# EAGLE schematic Preliminary_Schematic (EAGLE 9.5.1)
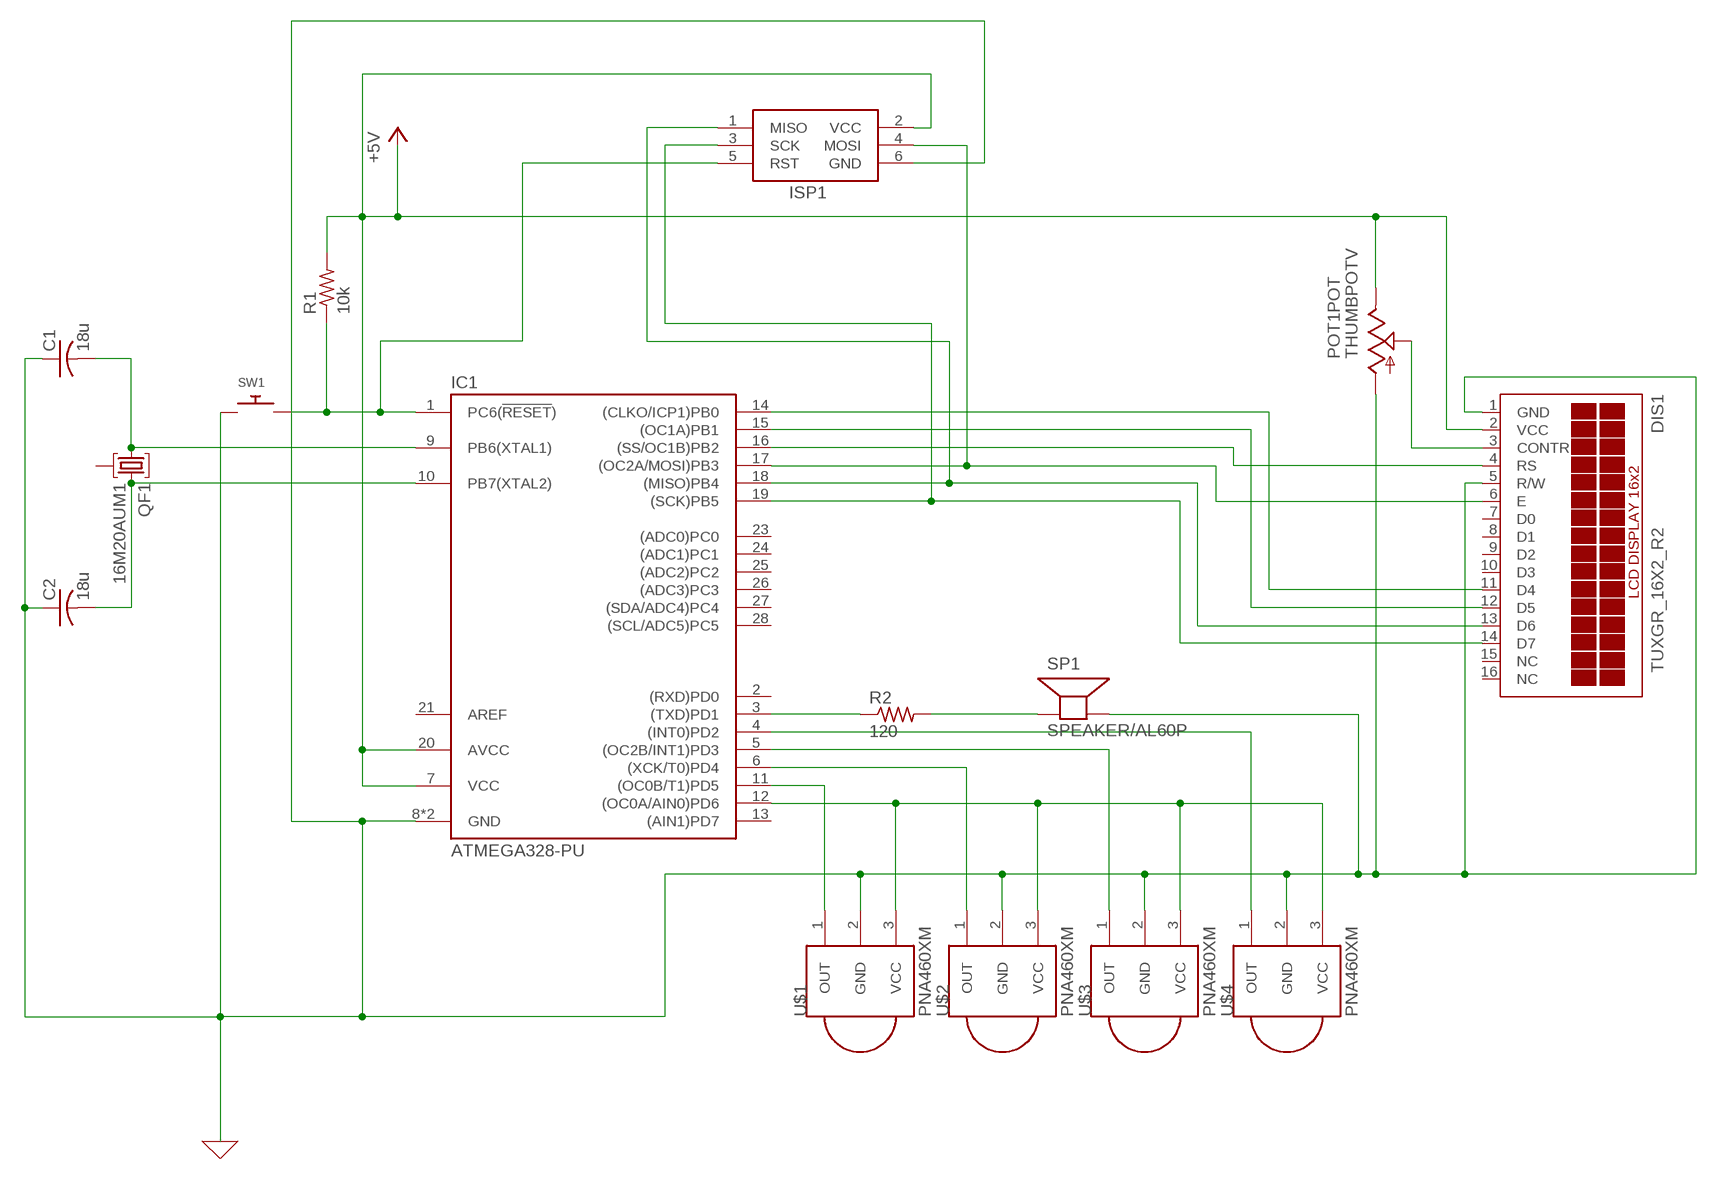
[diagram p0: schematic, sheet 1]

## Parts
C1  18u  C-USC0805  [C0805]
C2  18u  C-USC0805  [C0805]
DIS1  TUXGR_16X2_R2  [TUXGR_16X2_R2]
IC1  ATMEGA328-PU  [DIL28]
ISP1  AVRISP-6  [AVRISP]
POT1  THUMBPOTV  [THUMBWHEELV]
QF1  16M20AUM1  [UM1]
R1  10k  R-US_R0805  [R0805]
R2  120  R-US_R0805  [R0805]
SP1  SPEAKER/AL60P  [AL60P]
SW1  SWITCH_PUSHBUTTONC&K_KSS  [BTN_CK_KSS]
U$1  PNA460XM  [PNA460XM]
U$2  PNA460XM  [PNA460XM]
U$3  PNA460XM  [PNA460XM]
U$4  PNA460XM  [PNA460XM]

## Nets
0: C1.1 C2.1 DIS1.1(GND) DIS1.5(R/W) IC1.8(GND) IC1.22(GND) ISP1.6(GND) POT1.A(POT:A) SP1.2(-) SW1.P$1 U$1.2(GND) U$2.2(GND) U$3.2(GND) U$4.2(GND) ; supply symbol labelled GND
+5V: DIS1.2(VCC) IC1.7(VCC) IC1.20(AVCC) ISP1.2(VCC) POT1.E(POT:E) R1.2
N$1: IC1.11((OC0B/T1)PD5) U$1.1(OUT)
N$2: IC1.6((XCK/T0)PD4) U$2.1(OUT)
N$3: IC1.5((OC2B/INT1)PD3) U$3.1(OUT)
N$4: IC1.4((INT0)PD2) U$4.1(OUT)
N$5: IC1.12((OC0A/AIN0)PD6) U$1.3(VCC) U$2.3(VCC) U$3.3(VCC) U$4.3(VCC)
N$6: DIS1.3(CONTR) POT1.S(POT:S)
N$7: C2.2 IC1.10(PB7(XTAL2)) QF1.3
N$8: C1.2 IC1.9(PB6(XTAL1)) QF1.1
N$9: DIS1.13(D6) IC1.18((MISO)PB4) ISP1.1(MISO)
N$10: DIS1.4(RS) IC1.16((SS/OC1B)PB2)
N$11: DIS1.14(D7) IC1.19((SCK)PB5) ISP1.3(SCK)
N$12: DIS1.6(E) IC1.17((OC2A/MOSI)PB3) ISP1.4(MOSI)
N$13: DIS1.12(D5) IC1.15((OC1A)PB1)
N$14: DIS1.11(D4) IC1.14((CLKO/ICP1)PB0)
N$16: IC1.1(PC6(!RESET!)) ISP1.5(RST) R1.1 SW1.P$2
N$18: IC1.3((TXD)PD1) R2.1
N$19: R2.2 SP1.1(+)
Unconnected: DIS1.7(D0) DIS1.8(D1) DIS1.9(D2) DIS1.10(D3) DIS1.15(NC) DIS1.16(NC) IC1.2((RXD)PD0) IC1.13((AIN1)PD7) IC1.21(AREF) IC1.23((ADC0)PC0) IC1.24((ADC1)PC1) IC1.25((ADC2)PC2) IC1.26((ADC3)PC3) IC1.27((SDA/ADC4)PC4) IC1.28((SCL/ADC5)PC5) POT1.SW1(SW:S) POT1.SW2(SW:P) QF1.2

## Library data of the parts
C1 C2 = adafruit:C-US: CAPACITOR, American symbol
DIS1 = display-lcd:TUXGR_16X2_R2: Tuxgraphics LCD display 16x2 characters reflective, without background light Source: tuxgr_12x2_r2.pdf; OC_FARNELL: unknown; OC_NEWARK: unknown
IC1 = ATMEGA328-PU:ATMEGA328-PU: Atmel ATmega48/88/168/328 AVR Microcontroller; AVAILABILITY: Unavailable; DESCRIPTION: ATmega Series 20 MHz 32 KB Flash 2 KB SRAM 8-Bit Microcontroller - DIP-28; MF: Microchip; MP: ATMEGA328-PU; PACKAGE: PDIP-28 Microchip; PRICE: None
ISP1 = adafruit:AVRISP: AVR ISP HEADER Standard 6 pin header for AVR programming
POT1 = adafruit:THUMBPOT: Thumbwheel pot with switch Available in horizontal (Alpha RV121SF) or vertical (Xicon 311-1701)
QF1 = crystal:16M20AUM1: Monolithic Crystal Filters Source: www.vanlong.com; OC_FARNELL: unknown; OC_NEWARK: unknown
R1 R2 = adafruit:R-US_: RESISTOR, American symbol
SP1 = adafruit:SPEAKER: SPEAKER Source: Buerklin Added PS12 (for part # PS1240 piezo) http://www.ladyada.net/library/pcb/eaglelibrary.html
SW1 = adafruit:SWITCH_PUSHBUTTON: Buttons SOFTTOUCHSMD_SJ - Soft touch temporary push button (Super Junk Akihabara) Compatible with SKPMANE010 [Mouser: 688-SKPMAN] C&K_KSS = Digikey: KSS221GLFS
U$1-U$4 = adafruit:PNA460XM: IR 38KHz receiver PNA4602 and related receivers http://www.ladyada.net/library/pcb/eaglelibrary.html